# EAGLE design LedBoard (EAGLE 6.4)
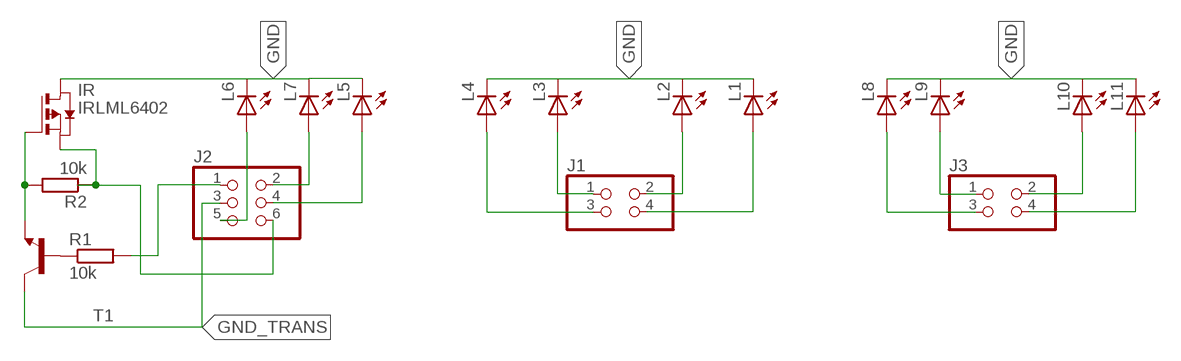
[diagram p0: schematic, sheet 1]

## Parts
IR  IRLML6402  [SOT-23]
J1  PINHD-2X2  [2X02]
J2  PINHD-2X3  [2X03]
J3  PINHD-2X2  [2X02]
L1  LEDKA-3528ASYC  [KA-3528ASYC]
L2  LEDKA-3528ASYC  [KA-3528ASYC]
L3  LEDKA-3528ASYC  [KA-3528ASYC]
L4  LEDKA-3528ASYC  [KA-3528ASYC]
L5  LEDKA-3528ASYC  [KA-3528ASYC]
L6  LEDKA-3528ASYC  [KA-3528ASYC]
L7  LEDKA-3528ASYC  [KA-3528ASYC]
L8  LEDKA-3528ASYC  [KA-3528ASYC]
L9  LEDKA-3528ASYC  [KA-3528ASYC]
L10  LEDKA-3528ASYC  [KA-3528ASYC]
L11  LEDKA-3528ASYC  [KA-3528ASYC]
R1  10k  R-EU_R1206  [R1206]
R2  10k  R-EU_R1206  [R1206]
T1  BC818-40-NPN-SOT23-BEC  [SOT23-BEC]

## Nets
GND: IR.3(D) L1.C L2.C L3.C L4.C L5.C L6.C L7.C L8.C L9.C L10.C L11.C
GND_TRANS: J2.3 T1.C
N$1: J1.4 L1.A
N$2: IR.1(G) R2.2 T1.E
N$3: J1.2 L2.A
N$4: J1.1 L3.A
N$5: J1.3 L4.A
N$6: J2.4 L5.A
N$7: J2.5 L6.A
N$8: J3.4 L11.A
N$9: IR.2(S) J2.6 R2.1
N$10: R1.1 T1.B
N$11: J3.2 L10.A
N$12: J3.1 L9.A
N$13: J3.3 L8.A
N$14: J2.2 L7.A
N$15: J2.1 R1.2

## Library data of the parts
IR = IRLML6402:IRLML6402
J1 J3 = pinhead:PINHD-2X2: PIN HEADER
J2 = pinhead:PINHD-2X3: PIN HEADER
L1-L11 = led:LED: LED OSRAM: - CHIPLED LG R971, LG N971, LY N971, LG Q971, LY Q971, LO R971, LY R971 LH N974, LH R974 LS Q976, LO Q976, LY Q976 LO Q996 - Hyper CHIPLED LW Q18S LB Q993, LB Q99A, LB R99A - SideLED LS A670, LO A670, LY A670, LG A670, LP A670 LB A673, LV A673, LT A673, LW A673 LH A674 LY A675 LS A676, LA A676, LO A676, LY A676, LW A676 LS A679, LY A679, LG A679 - Hyper Micro SIDELED® LS Y876, LA Y876, LO Y876, LY Y876 LT Y87S - SmartLED LW L88C, LW L88S LB L89C, LB L89S, LG L890 LS L89K, LO L89K, LY L89K LS L896, LA L896, LO L896, LY L896 - TOPLED LS T670, LO T670, LY T670, LG T670, LP T670 LSG T670, LSP T670, LSY T670, LOP T670, LYG T670 LG T671, LOG T671, LSG T671 LB T673, LV T673, LT T673, LW T673 LH T674 LS T676, LA T676, LO T676, LY T676, LB T676, LH T676, LSB T676, LW T676 LB T67C, LV T67C, LT T67C, LS T67K, LO T67K, LY T67K, LW E67C LS E67B, LA E67B, LO E67B, LY E67B, LB E67C, LV E67C, LT E67C LW T67C LS T679, LY T679, LG T679 LS T770, LO T770, LY T770, LG T770, LP T770 LB T773, LV T773, LT T773, LW T773 LH T774 LS E675, LA E675, LY E675, LS T675 LS T776, LA T776, LO T776, LY T776, LB T776 LHGB T686 LT T68C, LB T68C - Hyper Mini TOPLED® LB M676 - Mini TOPLED Santana® LG M470 LS M47K, LO M47K, LY M47K Source: http://www.osram.convergy.de LUXEON: - LUMILED® LXK2-PW12-R00, LXK2-PW12-S00, LXK2-PW14-U00, LXK2-PW14-V00 LXK2-PM12-R00, LXK2-PM12-S00, LXK2-PM14-U00 LXK2-PE12-Q00, LXK2-PE12-R00, LXK2-PE12-S00, LXK2-PE14-T00, LXK2-PE14-U00 LXK2-PB12-K00, LXK2-PB12-L00, LXK2-PB12-M00, LXK2-PB14-N00, LXK2-PB14-P00, LXK2-PB14-Q00 LXK2-PR12-L00, LXK2-PR12-M00, LXK2-PR14-Q00, LXK2-PR14-R00 LXK2-PD12-Q00, LXK2-PD12-R00, LXK2-PD12-S00 LXK2-PH12-R00, LXK2-PH12-S00 LXK2-PL12-P00, LXK2-PL12-Q00, LXK2-PL12-R00 Source: www.luxeon.com KINGBRIGHT: KA-3528ASYC Source: www.kingbright.com
R1 R2 = resistor:R-EU_: RESISTOR, European symbol
T1 = transistor:*-NPN-: NPN Transistror BF959 corrected 2008.03.06

## Board
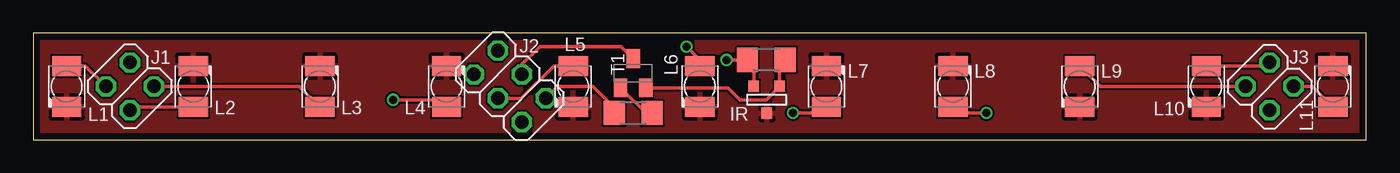
[diagram p1: board, top side]
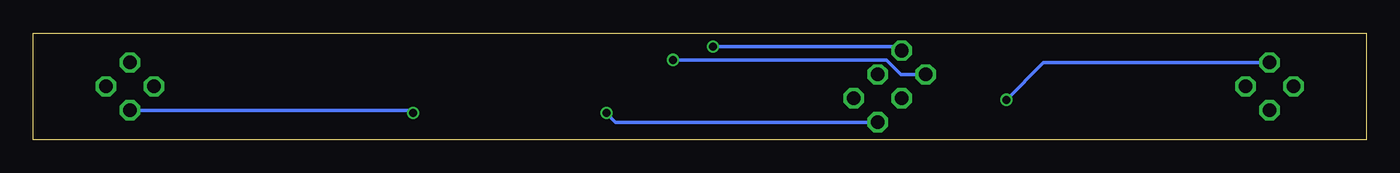
[diagram p2: board, bottom side, seen from below]

Size 100 x 8 mm. Coordinates in mm from the lower left corner, seen from the top.
Outline: 0,0 100,0 100,8 0,8 0,0
Copper layers (1*16): Top 0.035mm / dielectric 1.6mm / Bottom 0.035mm
Design rules "Elecrow_2-layer_PCB_eagle_rule": minimum track width 6mil, minimum drill 12mil, track to track 6mil, track to pad 6mil, pad to pad 6mil, via to via 8mil, smd to smd 0mil, copper to edge 20mil, drill to drill 10mil, minimum pad ring 6mil, minimum via ring 6mil, stop-mask expansion 0mil, vias tented up to drill 100mil, thermal gap 10mil

### Footprints (pad centres in the part's own frame; a part is rotated, then mirrored left to right if it is on the bottom)
SOT-23 = smd 0.787 x 0.889: 1 0.991,1.016; 2 -0.94,1.016; 3 0.025,-1.016
2X02 = drill 1.016 octagon: 1 -1.27,-1.27; 2 -1.27,1.27; 3 1.27,-1.27; 4 1.27,1.27
2X03 = drill 1.016 octagon: 1 -2.54,-1.27; 2 -2.54,1.27; 3 0,-1.27; 4 0,1.27; 5 2.54,-1.27; 6 2.54,1.27
KA-3528ASYC = smd 1.5 x 2.2: A -1.55,0; C 1.55,0
R1206 = smd 1.6 x 1.803: 1 -1.422,0; 2 1.422,0
SOT23-BEC = smd 1 x 1.4: B -0.95,-1.1; C 0,1.1; E 0.95,-1.1

### Placement (x,y rotation side)
IR  55,3 0 top
J1  7.25,4 135 top
J2  35.75,4 135 top
J3  92.75,4 315 top
L1  2.5,4 270 top
L2  12,4 90 top
L3  21.5,4 90 top
L4  31,4 90 top
L5  40.5,4 270 top
L6  50,4 270 top
L7  59.5,4 90 top
L8  69,4 90 top
L9  78.5,4 270 top
L10  88,4 270 top
L11  97.5,4 90 top
R1  45,2 180 top
R2  55,6 0 top
T1  45,5 0 top

### Tracks (layer width: path | path; a pad name or v marks a point on that pad's centre or on a via)
GND
  pour Top: 101,10 -1,10 -1.25,-2 100.75,-2
GND_TRANS
  Top 0.254: J2.3 36.65,5.65 38,7 44.1,7 T1.C
N$1
  Top 0.254: L1.A 3.9,5.55 J1.4
N$2
  Top 0.254: R2.2 55.99,5.57 IR.1 55.99,3.99 55,3 53,3 52.1,3.9 T1.E
N$3
  Top 0.254: L2.A 7.5,2.45 J1.2
N$4
  Top 0.254: J1.1 19.95,4 L3.A
N$5  (via drill 0.6)
  Top 0.254: v27,3 30.45,3 L4.A
  Bottom 0.254: J1.3 24.2,5.8 v27,3
N$6
  Top 0.254: J2.4 36.6,3.1 39.05,5.55 L5.A
N$7  (via drill 0.6)
  Top 0.254: L6.A 50,6 v49,7
  Bottom 0.254: v49,7 35.16,7 J2.5
N$8
  Top 0.254: J3.4 95.95,4 L11.A
N$9  (via drill 0.6)
  Top 0.254: IR.2 54.06,5.52 R2.1 v52,6
  Bottom 0.254: J2.6 34.9,4.9 36,6 v52,6
N$10
  Top 0.254: R1.1 45.95,2 T1.B
N$11
  Top 0.254: L10.A 92.5,5.55 J3.2
N$12
  Top 0.254: J3.1 80.05,4 L9.A
N$13  (via drill 0.6)
  Top 0.254: v71.5,2 69.45,2 L8.A
  Bottom 0.254: J3.3 71.7,2.2 v71.5,2
N$14  (via drill 0.6)
  Top 0.254: v57,2 59.05,2 L7.A
  Bottom 0.254: J2.2 56.31,1.31 v57,2
N$15
  Top 0.254: R1.2 43.58,2.42 42,4 39.34,4 J2.1